# Altium schematic sheet Power_Regulation.SchDoc
size A4
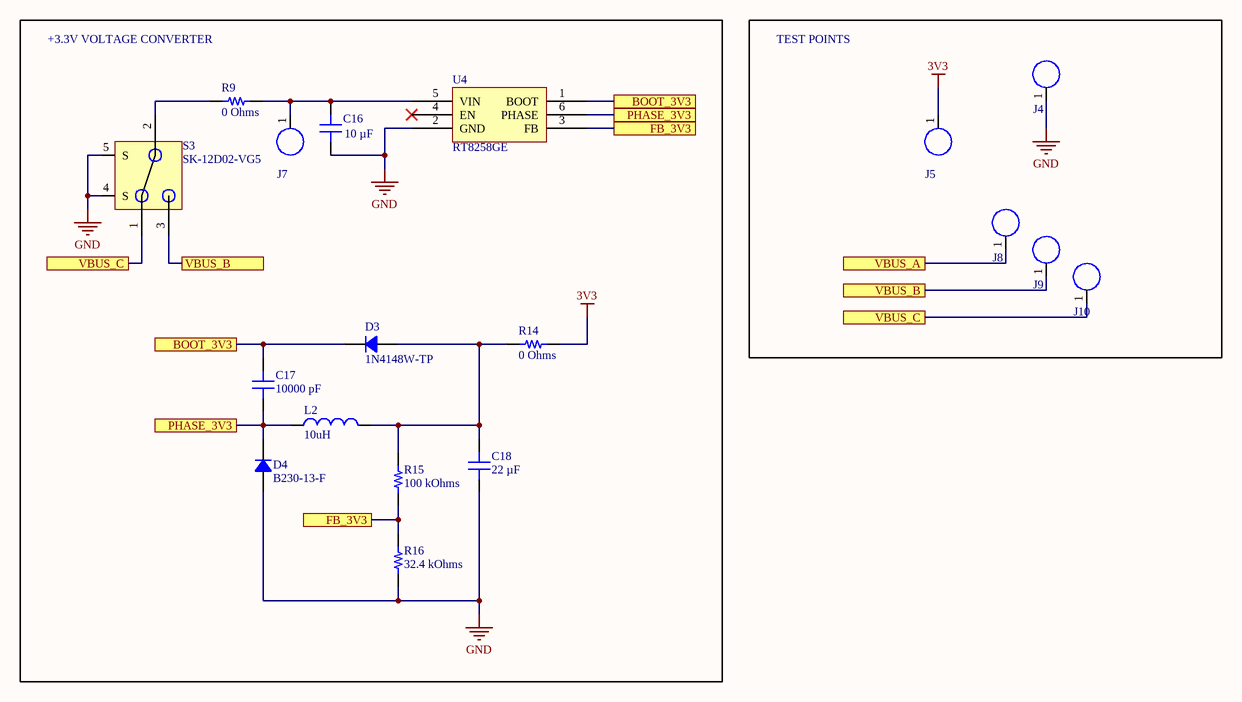
[diagram p0: Power_Regulation.SchDoc]

## Parts
C16  10 µF  [CAP 1206_3216 - 0.8MM]
C17  10000 pF  [CAP 0402_1005]
C18  22 µF  [CAP 1206_3216 - 0.8MM]
D3  1N4148W-TP  [SOD-123]
D4  B230-13-F  [DO214AA SMB]
J4  Large Board Solder Point  [Large Solder Point]  (value not drawn)  (no BOM)
J5  Large Board Solder Point  [Large Solder Point]  (value not drawn)  (no BOM)
J7  Large Board Solder Point  [Large Solder Point]  (value not drawn)  (no BOM)
J8  Large Board Solder Point  [Large Solder Point]  (value not drawn)  (no BOM)
J9  Large Board Solder Point  [Large Solder Point]  (value not drawn)  (no BOM)
J10  Large Board Solder Point  [Large Solder Point]  (value not drawn)  (no BOM)
L2  10uH  [0630CDMCCDS-100MC]
R9  0 Ohms  [RES 1210_3225]
R14  0 Ohms  [RES 1210_3225]
R15  100 kOhms  [RES 0402_1005]
R16  32.4 kOhms  [RES 0402_1005]
S3  SK-12D02-VG5  [SK-12D02-VG5]
U4  RT8258GE  [SOT100P279X130-6N]

## Blocks framed on the sheet
+3.3V VOLTAGE CONVERTER: C16-C18 D3 D4 J7 L2 R9 R14-R16 S3 U4
TEST POINTS: J4 J5 J8-J10

## Ports
BOOT_3V3, FB_3V3, PHASE_3V3, VBUS_A, VBUS_B, VBUS_C

## Nets
3V3: J5.1 R14.2
GND: C16.1 C18.2 D4.1 J4.1 R16.1 S3.4(S) S3.5(S) U4.2(GND)
BOOT_3V3: C17.2 D3.2 U4.1(BOOT) ; port BOOT_3V3
FB_3V3: R15.1 R16.2 U4.3(FB) ; port FB_3V3
PHASE_3V3: C17.1 D4.2 L2.1 U4.6(PHASE) ; port PHASE_3V3
VBUS_A: J8.1 ; port VBUS_A
VBUS_B: J9.1 S3.3 ; port VBUS_B
VBUS_C: J10.1 S3.1 ; port VBUS_C
NetC16_2: C16.2 J7.1 R9.2 U4.5(VIN)
NetC18_1: C18.1 D3.1 L2.2 R14.1 R15.2
NetR9_1: R9.1 S3.2(C)

Not connected (* = marked no-connect by the designer): U4 4(EN)*

## Library data of the parts
C16 = GRM31CR71E106MA12K: CAP CER 10UF 25V X7R 1206; manufacturer: Murata Electronics; Tolerance: ±20%; Part Number: GRM31CR71E106MA12K; Value: 10 µF; Applications: General Purpose; Capacitance: 10 µF; componentlink1description: Datasheet; componentlink1url: https://search.murata.co.jp/Ceramy/image/img/A01X/G101/ENG/GRM31CR71E106MA12-01CA.pdf; componentlink2description: DigiKey Link; componentlink2url: https://www.digikey.com/en/products/detail/murata-electronics/GRM31CR71E106MA12K/13904832; Device Package: 1206 (3216 Metric); lastupdated: 9/08/2022 12:05:16 PM; Lifecycle Status: Active; Minimum Order: 1; Mounting Type: Surface Mount, MLCC; Operating Temperature: -55°C ~ 125°C; Package / Case: 1206 (3216 Metric); packaging: TapeAndReel; partid: 30277; Part Status: Active; price: 0.07; series: GRM; Size / Dimension: 0.126" L x 0.063" W (3.20mm x 1.60mm); Supplier 1: DigiKey; Supplier Part Number 1: 490-GRM31CR71E106MA12KCT-ND; Temperature Coefficient: X7R; Thickness (Max): 0.071" (1.80mm); Voltage - Rated: 25V
C17 = VJ0402Y103JXQCW1BC: CAP CER 10000PF 10V X7R 0402; manufacturer: Vishay Vitramon; Tolerance: ±5%; Part Number: VJ0402Y103JXQCW1BC; Value: 10000 pF; Applications: General Purpose; Capacitance: 10000 pF; componentlink1description: Datasheet; componentlink1url: https://www.vishay.com/docs/28548/vjw1bcbascomseries.pdf; componentlink2description: DigiKey Link; componentlink2url: https://www.digikey.com/en/products/detail/vishay-vitramon/VJ0402Y103JXQCW1BC/8301965; Device Package: 0402 (1005 Metric); lastupdated: 9/08/2022 12:01:13 PM; Lifecycle Status: Active; Minimum Order: 1; Mounting Type: Surface Mount, MLCC; Operating Temperature: -55°C ~ 125°C; Package / Case: 0402 (1005 Metric); packaging: TapeAndReel; partid: 4459; Part Status: Active; price: 0.01; series: VJ; Size / Dimension: 0.039" L x 0.020" W (1.00mm x 0.50mm); Supplier 1: DigiKey; Supplier Part Number 1: 720-1645-1-ND; Temperature Coefficient: X7R; Thickness (Max): 0.022" (0.55mm); Voltage - Rated: 10V
C18 = GCM31CR70J226KE23L: CAP CER 22UF 6.3V X7R 1206; manufacturer: Murata Electronics; Tolerance: ±10%; Part Number: GCM31CR70J226KE23L; Value: 22 µF; Applications: Automotive; Capacitance: 22 µF; componentlink1description: Datasheet; componentlink1url: https://www.murata.com/~/media/webrenewal/support/library/catalog/products/capacitor/mlcc/c03e.ashx?la=en-us; componentlink2description: DigiKey Link; componentlink2url: https://www.digikey.com/en/products/detail/murata-electronics/GCM31CR70J226KE23L/1763914; Device Package: 1206 (3216 Metric); lastupdated: 9/08/2022 12:05:38 PM; Lifecycle Status: Active; Minimum Order: 1; Mounting Type: Surface Mount, MLCC; Operating Temperature: -55°C ~ 125°C; Package / Case: 1206 (3216 Metric); packaging: TapeAndReel; partid: 19505; Part Status: Active; price: 0.19; Ratings: AEC-Q200; series: GCM; Size / Dimension: 0.126" L x 0.063" W (3.20mm x 1.60mm); Supplier 1: DigiKey; Supplier Part Number 1: 490-4843-1-ND; Temperature Coefficient: X7R; Thickness (Max): 0.071" (1.80mm); Voltage - Rated: 6.3V
D3 = 1N4148W-TP: DIODE GEN PURP 100V 150MA SOD123; Manufacturer: Micro Commercial Co; Capacitance @ Vr, F: 2pF @ 0V, 1MHz; Current - Reverse Leakage @ Vr: 1 µA @ 75 V; Diode Type: Standard; Reverse Recovery Time (trr): 4 ns; Speed: Small Signal =< 200mA (Io), Any Speed; Voltage - Forward (Vf) (Max) @ If: 1.25 V @ 150 mA; Part Number: 1N4148W-TP; ComponentLink1Description: Datasheet; ComponentLink1URL: https://www.mccsemi.com/pdf/Products/1N4148W(SOD123).pdf; ComponentLink2Description: DigiKey Link; ComponentLink2URL: https://www.digikey.com/en/products/detail/micro-commercial-co/1N4148W-TP/717196; Current - Average Rectified (Io): 150mA; LastUpdated: 9/08/2022 12:37:52 PM; Lifecycle Status: Active; Minimum Order: 1; Mounting Type: Surface Mount; Operating Temperature - Junction: -65°C ~ 150°C; Package / Case: SOD-123; Packaging: TapeAndReel; PartId: 999; Part Status: Active; Price: 0.02; Series: -; Supplier 1: DigiKey; Supplier Part Number 1: 1N4148WTPMSCT-ND; Supplier Device Package: SOD-123; Voltage - DC Reverse (Vr) (Max): 100 V
D4 = B230-13-F: DIODE SCHOTTKY 30V 2A SMB; Manufacturer: Diodes Incorporated; Capacitance @ Vr, F: 200pF @ 4V, 1MHz; Current - Reverse Leakage @ Vr: 500 µA @ 30 V; Speed: Fast Recovery =< 500ns, > 200mA (Io); Voltage - Forward (Vf) (Max) @ If: 500 mV @ 2 A; Part Number: B230-13-F; ComponentLink1Description: Datasheet; ComponentLink1URL: https://www.diodes.com/assets/Datasheets/ds13004.pdf; ComponentLink2Description: DigiKey Link; ComponentLink2URL: https://www.digikey.com/en/products/detail/diodes-incorporated/B230-13-F/814955; Current - Average Rectified (Io): 2A; Diode Type: Schottky; LastUpdated: 9/08/2022 12:37:20 PM; Lifecycle Status: Active; Minimum Order: 1; Mounting Type: Surface Mount; Operating Temperature - Junction: -65°C ~ 150°C; Package / Case: DO-214AA, SMB; Packaging: TapeAndReel; PartId: 1539; Part Status: Active; Price: 0.13; Series: -; Supplier 1: DigiKey; Supplier Part Number 1: B230-FDICT-ND; Supplier Device Package: SMB; Voltage - DC Reverse (Vr) (Max): 30 V
L2 = 0630CDMCCDS-100MC: 4A 10uH ±20% 67mΩ SMD,7x6.6x2.8mm Power Inductors ROHS
R9 R14 = RC1210JR-070RL: RES 0 OHM JUMPER 1/2W 1210; Manufacturer: Yageo; Power (Watts): 0.5W, 1/2W; Part Number: RC1210JR-070RL; ComponentLink1Description: Datasheet; ComponentLink1URL: https://www.yageo.com/upload/media/product/productsearch/datasheet/rchip/PYu-RC_Group_51_RoHS_L_10.pdf; ComponentLink2Description: DigiKey Link; ComponentLink2URL: https://www.digikey.com/en/products/detail/yageo/RC1210JR-070RL/5919839; Composition: Thick Film; Device Package: 1210 (3225 Metric); Features: Moisture Resistant; Height - Seated (Max): 0.024" (0.60mm); LastUpdated: 9/08/2022 12:50:16 PM; Lifecycle Status: Active; Minimum Order: 1; Number of Terminations: 2; Operating Temperature: -55°C ~ 155°C; Package / Case: 1210 (3225 Metric); Packaging: TapeAndReel; Part Status: Active; Price: 0.01; Resistance: 0 Ohms; Series: RC_L; Size / Dimension: 0.122" L x 0.102" W (3.10mm x 2.60mm); Supplier 1: DigiKey; Supplier Part Number 1: YAG3375CT-ND; Supplier Device Package: 1210; Tolerance: Jumper; Value: 0 Ohms
R15 = RP73PF1E100KBTD: RES 100K OHM 0.1% 1/10W 0402; Manufacturer: TE Connectivity Passive Product; Power (Watts): 0.1W, 1/10W; Temperature Coefficient: ±25ppm/°C; Part Number: RP73PF1E100KBTD; Value: 100 kOhms; ComponentLink1Description: Datasheet; ComponentLink1URL: https://www.te.com/commerce/DocumentDelivery/DDEController?Action=srchrtrv&DocNm=1773272&DocType=DS&DocLang=English; ComponentLink2Description: DigiKey Link; ComponentLink2URL: https://www.digikey.com/en/products/detail/te-connectivity-passive-product/RP73PF1E100KBTD/8261053; Composition: Thin Film; Device Package: 0402 (1005 Metric); Height - Seated (Max): 0.014" (0.35mm); LastUpdated: 9/08/2022 12:11:04 PM; Lifecycle Status: Active; Minimum Order: 1; Number of Terminations: 2; Operating Temperature: -55°C ~ 155°C; Package / Case: 0402 (1005 Metric); Packaging: TapeAndReel; PartId: 2436; Part Status: Active; Price: 0.09; Resistance: 100 kOhms; Series: RP73, Holsworthy; Size / Dimension: 0.039" L x 0.020" W (1.00mm x 0.50mm); Supplier 1: DigiKey; Supplier Part Number 1: A127511CT-ND; Supplier Device Package: 0402; Tolerance: ±0.1%
R16 = CPF0402B32K4E1: RES SMD 32.4KOHM 0.1% 1/16W 0402; Manufacturer: TE Connectivity Passive Product; Power (Watts): 0.063W, 1/16W; Temperature Coefficient: ±25ppm/°C; Part Number: CPF0402B32K4E1; Value: 32.4 kOhms; ComponentLink1Description: Datasheet; ComponentLink1URL: https://www.te.com/commerce/DocumentDelivery/DDEController?Action=srchrtrv&DocNm=1773200&DocType=DS&DocLang=English; ComponentLink2Description: DigiKey Link; ComponentLink2URL: https://www.digikey.com/en/products/detail/te-connectivity-passive-product/CPF0402B32K4E1/2382531; Composition: Thin Film; Device Package: 0402 (1005 Metric); Height - Seated (Max): 0.014" (0.35mm); LastUpdated: 9/08/2022 12:10:59 PM; Lifecycle Status: Active; Minimum Order: 1; Number of Terminations: 2; Operating Temperature: -55°C ~ 155°C; Package / Case: 0402 (1005 Metric); Packaging: TapeAndReel; PartId: 4116; Part Status: Active; Price: 0.15; Resistance: 32.4 kOhms; Series: CPF, Neohm; Size / Dimension: 0.039" L x 0.020" W (1.00mm x 0.50mm); Supplier 1: DigiKey; Supplier Part Number 1: A102795CT-ND; Supplier Device Package: 0402; Tolerance: ±0.1%
S3 = SK-12D02-VG5: Lying SPDT 9.5mm PCPin 5000 Rectangular columnar -25℃~+70℃ Plugin Slide Switches ROHS SP#C136722
U4 = RT8258GE: RICHTEK 1.2A, 24V, 700kHz Step-Down Converter SOT23-6